# Altium schematic sheet PowerBank.schdoc
size 306 x 214 mm; SheetNumber: 1; SheetTotal: 1
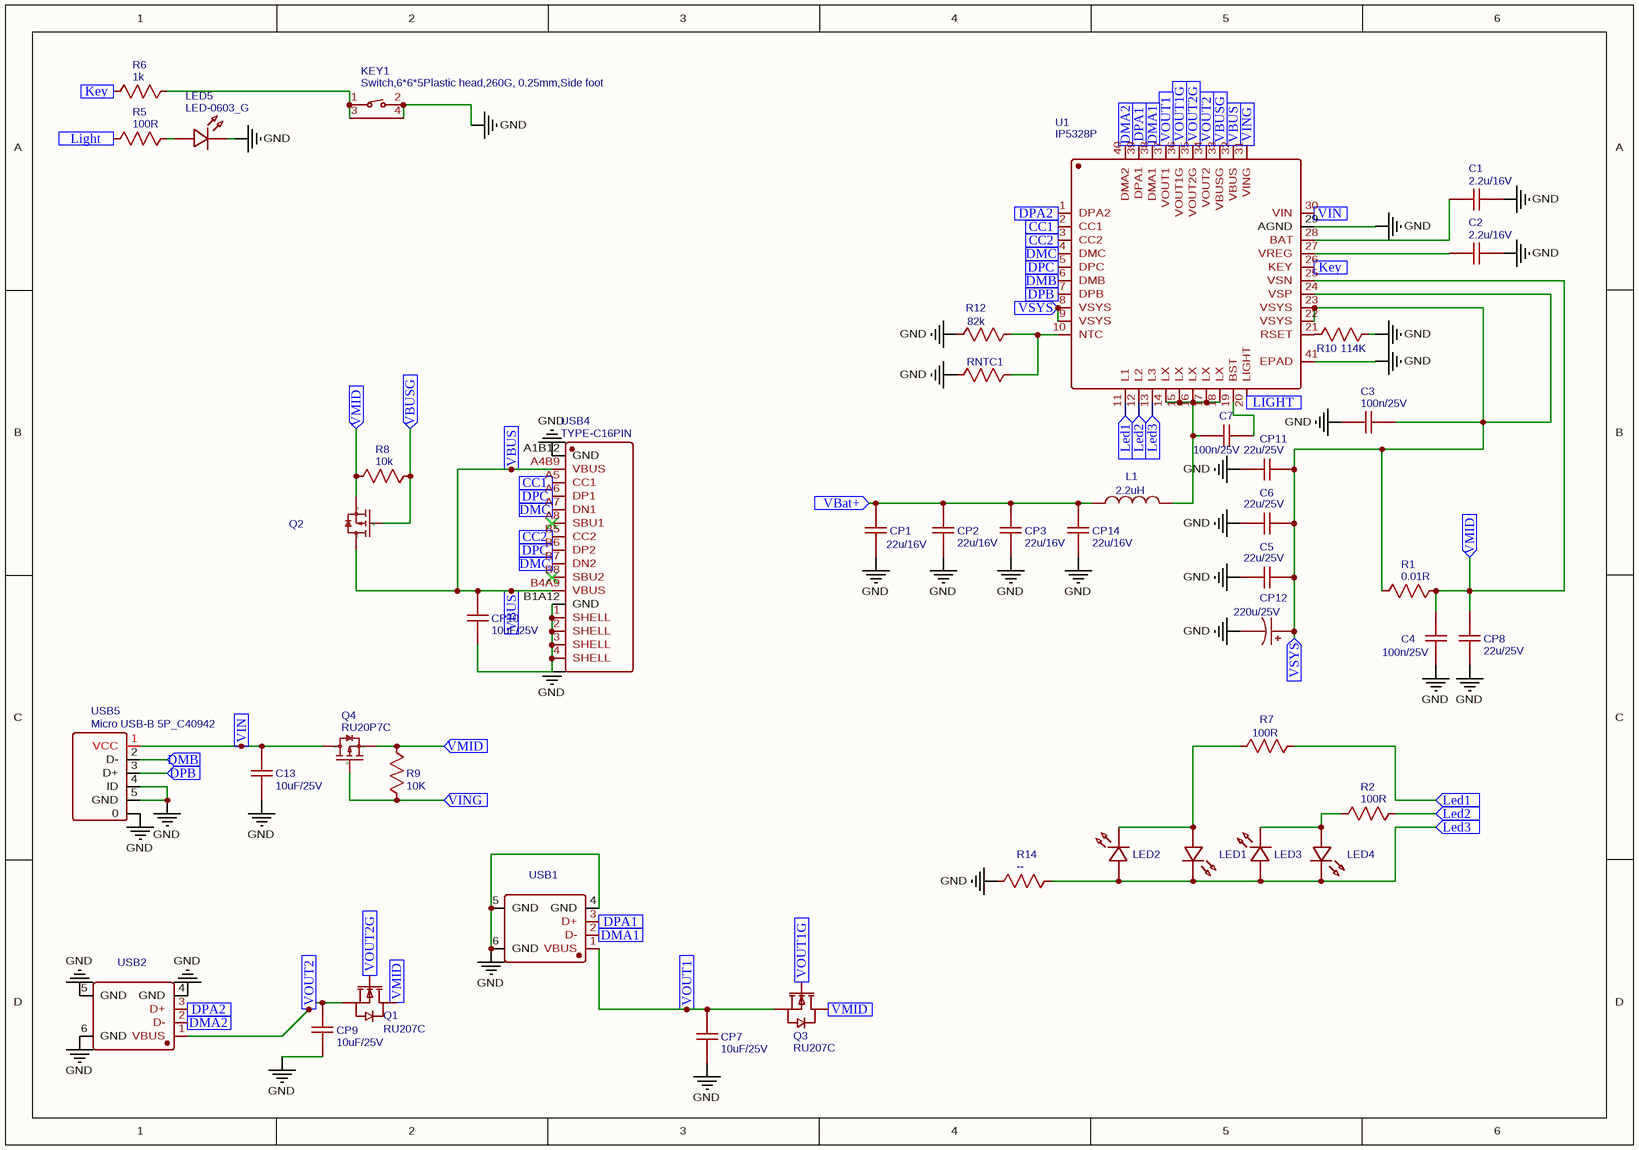
[diagram p0: PowerBank.schdoc]

## Parts
C1  2.2u/16V  [C0603]
C2  2.2u/16V  [C0603]
C3  100n/25V  [C0603]
C4  100n/25V  [C0603]
C5  22u/25V  [C0805]
C6  22u/25V  [C0805]
C7  100n/25V  [C0603]
C13  10uF/25V  [C0805]
CP1  22u/16V  [C0805]
CP2  22u/16V  [C0805]
CP3  22u/16V  [C0805]
CP7  10uF/25V  [C0805]
CP8  22u/25V  [C0805]
CP9  10uF/25V  [C0805]
CP10  10uF/25V  [C0805]
CP11  22u/25V  [C0805]
CP12  220u/25V  [CAP-D5.0×H5.5]
CP14  22u/16V  [C0805]
KEY1  Switch,6*6*5Plastic head,260G, 0.25mm,Side foot  [SW-TH_BBJ6X6X5PH260G]
L1  2.2uH  [INDUCTOR_SLF10145]
LED1  LED-0603_B  [LED0603_BLUE]  (value not drawn)
LED2  LED-0603_B  [LED0603_BLUE]  (value not drawn)
LED3  LED-0603_B  [LED0603_BLUE]  (value not drawn)
LED4  LED-0603_B  [LED0603_BLUE]  (value not drawn)
LED5  LED-0603_G  [LED0603_GREEN]
Q1  RU207C  [SOT-23-3_L2.9-W1.6-P1.90-LS2.8-BR]
Q2  RU20P7C  [SOT-23-3_L2.9-W1.3-P1.90-LS2.4-BR]  (value not drawn)
Q3  RU207C  [SOT-23-3_L2.9-W1.6-P1.90-LS2.8-BR]
Q4  RU20P7C  [SOT-23-3_L2.9-W1.3-P1.90-LS2.4-BR]
R1  0.01R  [R1206]
R2  100R  [R0603]
R5  100R  [R0603]
R6  1k  [R0603]
R7  100R  [R0603]
R8  10k  [R0603]
R9  10K  [R0603]
R10  114K  [R0603]
R12  82k  [R0603]
R14  --  [R0603]
RNTC1  1k  [R0603]  (value not drawn)
U1  IP5328P  [QFN-40_L6.0-W6.0-P0.50-BL-EP]
USB1  USB-234-ACY  [USB-A-SMD_USB-234-BCW]  (value not drawn)
USB2  USB-234-ACY  [USB-A-SMD_USB-234-BCW]  (value not drawn)
USB4  TYPE-C16PIN  [USB-C-SMD_TYPE-C16PIN]
USB5  Micro USB-B 5P_C40942  [MICRO-USB-SMD_5P-P0.65-H-M_MICRO-USB-5P]

## Ports
CC1 (in, see PowerBank[2B]), CC1 (in, see PowerBank[4A]), CC2 (in, see PowerBank[2B]), CC2 (in, see PowerBank[4A]), DMA1 (in, see PowerBank[3D]), DMA1 (in, see PowerBank[5A]), DMA2 (in, see PowerBank[1D]), DMA2 (in, see PowerBank[5A]), DMB (in, see PowerBank[1C]), DMB (in, see PowerBank[4A]), DMC (in, see PowerBank[2B]), DMC (in, see PowerBank[2B], PowerBank[4A]), DPA1 (in, see PowerBank[3D]), DPA1 (in, see PowerBank[5A]), DPA2 (in, see PowerBank[1D]), DPA2 (in, see PowerBank[4A]), DPB (in, see PowerBank[1C]), DPB (in, see PowerBank[4B]), DPC (in, see PowerBank[2B]), DPC (in, see PowerBank[2B], PowerBank[4A]), Key (in, see PowerBank[1A]), Key (in, see PowerBank[5A]), Led1 (in, see PowerBank[5B]), Led1 (in, see PowerBank[6C]), Led2 (in, see PowerBank[5B]), Led2 (in, see PowerBank[6C]), Led3 (in, see PowerBank[5B]), Led3 (in, see PowerBank[6C]), LIGHT (in, see PowerBank[1A]), Light (in, see PowerBank[5B]), VBat+ (in), VBUS (in, see PowerBank[2B], PowerBank[2C]), VBUS (in, see PowerBank[2B], PowerBank[5A]), VBUS (in, see PowerBank[2C], PowerBank[5A]), VBUSG (in, see PowerBank[2B]), VBUSG (in, see PowerBank[5A]), VIN (in, see PowerBank[1C]), VIN (in, see PowerBank[5A]), VING (in, see PowerBank[2C]), VING (in, see PowerBank[5A]), VMID (in, see PowerBank[2B], PowerBank[2C], PowerBank[2D], PowerBank[4D]), VMID (in, see PowerBank[2B], PowerBank[2C], PowerBank[2D], PowerBank[6B]), VMID (in, see PowerBank[2B], PowerBank[2C], PowerBank[4D], PowerBank[6B]), VMID (in, see PowerBank[2B], PowerBank[2D], PowerBank[4D], PowerBank[6B]), VMID (in, see PowerBank[2C], PowerBank[2D], PowerBank[4D], PowerBank[6B]), VOUT1 (in, see PowerBank[3D]), VOUT1 (in, see PowerBank[5A]), VOUT1G (in, see PowerBank[3D]), VOUT1G (in, see PowerBank[5A]), VOUT2 (in, see PowerBank[2D]), VOUT2 (in, see PowerBank[5A]), VOUT2G (in, see PowerBank[2D]), VOUT2G (in, see PowerBank[5A]), VSYS (in, see PowerBank[4B]), VSYS (in, see PowerBank[5C])

## Nets
GND: C1.2 C2.2 C3.1 C4.2 C5.1 C6.1 C13.2 CP1.2 CP2.2 CP3.2 CP7.2 CP8.2 CP9.2 CP10.1 CP11.1 CP12.2 CP14.2 KEY1.2 KEY1.4 LED5.2 R10.2 R12.1 R14.1 RNTC1.1 U1.29(AGND) U1.41(EPAD) USB1.4(GND) USB1.5(GND) USB1.6(GND) USB2.4(GND) USB2.5(GND) USB2.6(GND) USB4.1(SHELL) USB4.2(SHELL) USB4.3(SHELL) USB4.4(SHELL) USB4.A1B12(GND) USB4.B1A12(GND) USB5.0 USB5.4(ID) USB5.5(GND)
CC1: U1.2(CC1) USB4.A5(CC1) ; port CC1
CC2: U1.3(CC2) USB4.B5(CC2) ; port CC2
DMA1: U1.38(DMA1) USB1.2(D-) ; port DMA1
DMA2: U1.40(DMA2) USB2.2(D-) ; port DMA2
DMB: U1.6(DMB) USB5.2(D-) ; port DMB
DMC: U1.4(DMC) USB4.A7(DN1) USB4.B7(DN2) ; port DMC
DPA1: U1.39(DPA1) USB1.3(D+) ; port DPA1
DPA2: U1.1(DPA2) USB2.3(D+) ; port DPA2
DPB: U1.7(DPB) USB5.3(D+) ; port DPB
DPC: U1.5(DPC) USB4.A6(DP1) USB4.B6(DP2) ; port DPC
Key: R6.1 U1.26(KEY) ; port Key
Led1: R7.2 U1.11(L1) ; port Led1
Led2: R2.2 U1.12(L2) ; port Led2
Led3: LED1.2 LED2.1 LED3.1 LED4.2 R14.2 U1.13(L3) ; port Led3
LIGHT: R5.1 U1.20(LIGHT) ; port LIGHT, port Light
VBat+: CP1.1 CP2.1 CP3.1 CP14.1 L1.1 ; port VBat+
VBUS: CP10.2 Q2.3(D) U1.32(VBUS) USB4.A4B9(VBUS) USB4.B4A9(VBUS) ; port VBUS
VBUSG: Q2.1(G) R8.1 U1.33(VBUSG) ; port VBUSG
VIN: C13.1 Q4.3(D) U1.30(VIN) USB5.1(VCC) ; port VIN
VING: Q4.1(G) R9.1 U1.31(VING) ; port VING
VMID: C4.1 CP8.1 Q1.3(D) Q2.2(S) Q3.3(D) Q4.2(S) R1.2 R8.2 R9.2 U1.25(VSN) ; port VMID
VOUT1: CP7.1 Q3.2(S) U1.37(VOUT1) USB1.1(VBUS) ; port VOUT1
VOUT1G: Q3.1(G) U1.36(VOUT1G) ; port VOUT1G
VOUT2: CP9.1 Q1.2(S) U1.34(VOUT2) USB2.1(VBUS) ; port VOUT2
VOUT2G: Q1.1(G) U1.35(VOUT2G) ; port VOUT2G
VSYS: C3.2 C5.2 C6.2 CP11.2 CP12.1 R1.1 U1.8(VSYS) U1.9(VSYS) U1.22(VSYS) U1.23(VSYS) U1.24(VSP) ; port VSYS
NetC1_1: C1.1 U1.28(BAT)
NetC2_1: C2.1 U1.27(VREG)
NetC7_1: C7.1 L1.2 U1.14(LX) U1.15(LX) U1.16(LX) U1.17(LX) U1.18(LX)
NetC7_2: C7.2 U1.19(BST)
NetKEY1_1: KEY1.1 KEY1.3 R6.2
NetLED1_1: LED1.1 LED2.2 R7.1
NetLED3_2: LED3.2 LED4.1 R2.1
NetLED5_1: LED5.1 R5.2
NetR10_1: R10.1 U1.21(RSET)
NetR12_2: R12.2 RNTC1.2 U1.10(NTC)

Not connected (* = marked no-connect by the designer): USB4 A8(SBU1)* B8(SBU2)*

## Library data of the parts
C1 C2 = 2.2u/16V: nameAlias: Value(F); Contributor: LCEDA_Lib; spicePre: C; spiceSymbolName: C_0603_US
C3 C4 C7 = 100n/25V: nameAlias: Value(F); Contributor: LCEDA_Lib; spicePre: C; spiceSymbolName: C_0603_US
C5 C6 CP8 CP11 = 22u/25V: nameAlias: Value(F); Contributor: LCEDA_Lib; spicePre: C; spiceSymbolName: C_0805_US
C13 CP7 CP9 CP10 = 10uF/25V: nameAlias: Value(F); Contributor: LCEDA_Lib; spicePre: C; spiceSymbolName: C_0805_US
CP1-CP3 CP14 = 22u/16V: nameAlias: Value(F); Contributor: LCEDA_Lib; spicePre: C; spiceSymbolName: C_0805_US
CP12 = 220u/25V: nameAlias: Value(F); Contributor: LCEDA_Lib; spicePre: C; spiceSymbolName: CE_SMD_D5.0×H5.5_US
KEY1 = Switch,6*6*5Plastic head,260G, 0.25mm,Side foot: Manufacturer: BBJ; Supplier Part: C71832; Supplier: LCSC; Manufacturer Part: Switch,6*6*5Plastic head,260G, 0.25mm,Side foot; spicePre: K; spiceSymbolName: Switch,6*6*5Plastic head,260G, 0.25mm,Side foot
LED1-LED4 = LED-0603_B: Manufacturer: EVERLIGHT(台湾亿光); Manufacturer Part: 19-217/BHC-ZL1M2RY/3T; Contributor: LCEDA_01; Supplier Part: C72041; Supplier: LCSC; spicePre: L; spiceSymbolName: LED-0603_B
LED5 = LED-0603_G: Manufacturer: EVERLIGHT(台湾亿光); Manufacturer Part: 19-217/GHC-YR1S2/3T; Contributor: LCEDA_Lib; Supplier Part: C72043; Supplier: LCSC; spicePre: L; spiceSymbolName: LED-0603_G
Q1 Q3 = RU207C: Manufacturer: INJOINIC; Contributor: LCSC; SMT Type: Extend; Paste Type: expand; Supplier: LCSC; Supplier Part: C515680; Manufacturer Part: RU207C; JLCPCB SMD: Yes; LCSC Assembly: Yes; Assembly Type: smtWeld; spicePre: Q; spiceSymbolName: RU207C
Q2 Q4 = RU20P7C: Manufacturer: Ruichips; Contributor: LCSC; SMT Type: Extend; Paste Type: expand; Supplier: LCSC; Manufacturer Part: RU20P7C; Supplier Part: C181984; JLCPCB SMD: Yes; LCSC Assembly: Yes; Assembly Type: smtWeld; spicePre: Q; spiceSymbolName: RU20P7C
R1 = 0.01R: nameAlias: Value(Ω); Contributor: LCEDA_Lib; spicePre: R; spiceSymbolName: R_1206_US
R2 R5 R7 = 100R: nameAlias: Value(Ω); Contributor: LCEDA_Lib; spicePre: R; spiceSymbolName: R_0603_US
R6 RNTC1 = 1k: nameAlias: Value(Ω); Contributor: LCEDA_Lib; spicePre: R; spiceSymbolName: R_0603_US
R8 = 10k: nameAlias: Value(Ω); Contributor: LCEDA_Lib; spicePre: R; spiceSymbolName: R_0603_US
R9 = 10K: nameAlias: Value(Ω); Contributor: LCEDA_Lib; spicePre: R; spiceSymbolName: R_0603_US
R10 = 114K: nameAlias: Value(Ω); Contributor: LCEDA_Lib; spicePre: R; spiceSymbolName: R_0603_US
R12 = 82k: nameAlias: Value(Ω); Contributor: LCEDA_Lib; spicePre: R; spiceSymbolName: R_0603_US
R14 = --: nameAlias: Value(Ω); Contributor: LCEDA_Lib; spicePre: R; spiceSymbolName: R_0603_US
U1 = IP5328P: Manufacturer: INJOINIC; Contributor: LCSC; SMT Type: Extend; Paste Type: expand; Supplier: LCSC; Supplier Part: C188809; Manufacturer Part: IP5328P; JLCPCB SMD: Yes; LCSC Assembly: Yes; Assembly Type: smtWeld; spicePre: U; spiceSymbolName: IP5328P
USB1 USB2 = USB-234-ACY: Manufacturer: XUNPU; Contributor: LCSC; Supplier: LCSC; Supplier Part: C720527; Manufacturer Part: USB-234-ACY; spicePre: U; spiceSymbolName: USB-234-ACY
USB4 = TYPE-C16PIN: Manufacturer: SHOU HAN; Contributor: LCSC; Supplier: LCSC; Supplier Part: C393939; Manufacturer Part: TYPE-C16PIN; spicePre: U; spiceSymbolName: TYPE-C16PIN
USB5 = Micro USB-B 5P_C40942: Manufacturer: ValuePro; Supplier: LCSC; Manufacturer Part: Micro USB-B 5P_C40942; image: //image.lceda.cn/szlcsc/C40942.jpg; Supplier Part: C40942; spicePre: U; spiceSymbolName: Micro USB-B 5P_C40942
L1 = 2.2uH: spicePre: L; spiceSymbolName: L_USI